# EAGLE board slave (EAGLE 9.6.2), part 1 of 3
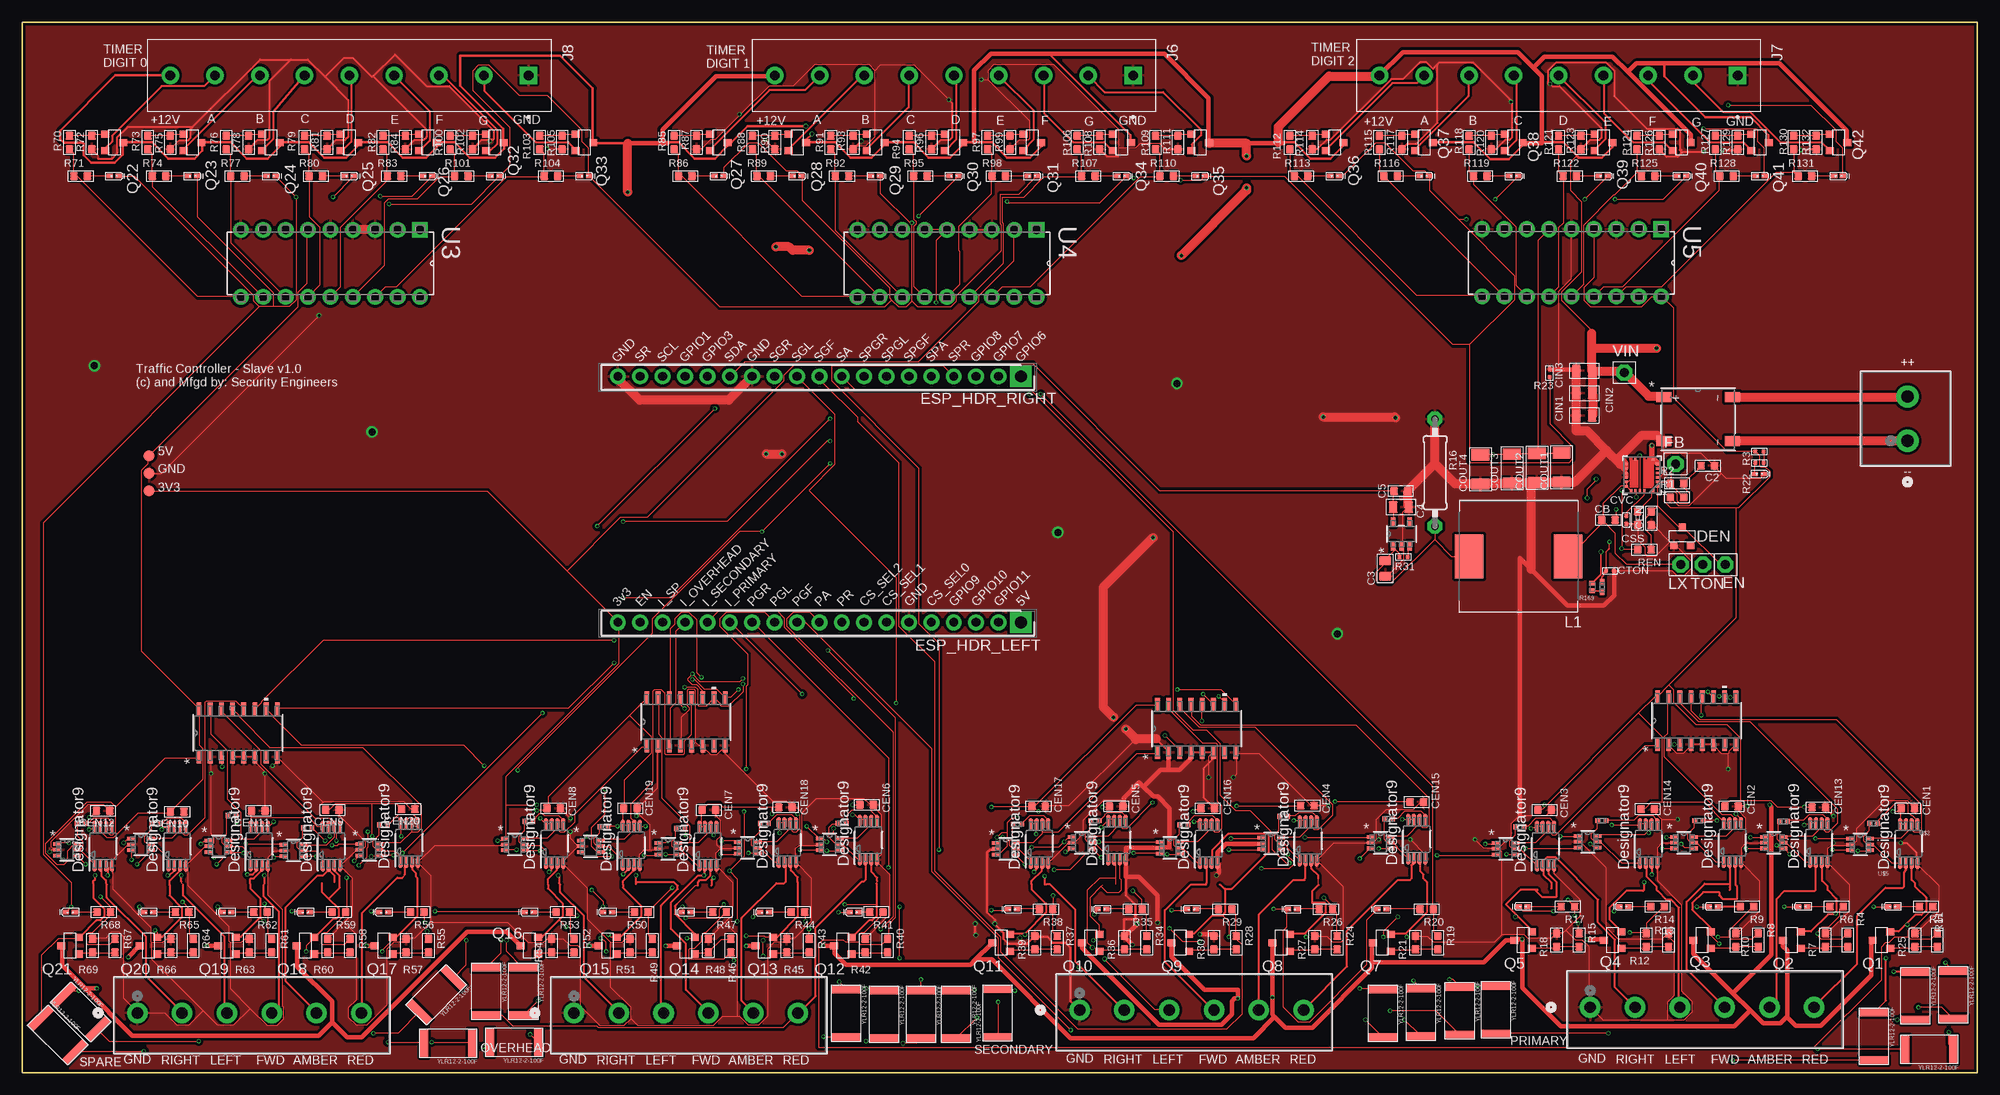
[diagram p6: board, top side]
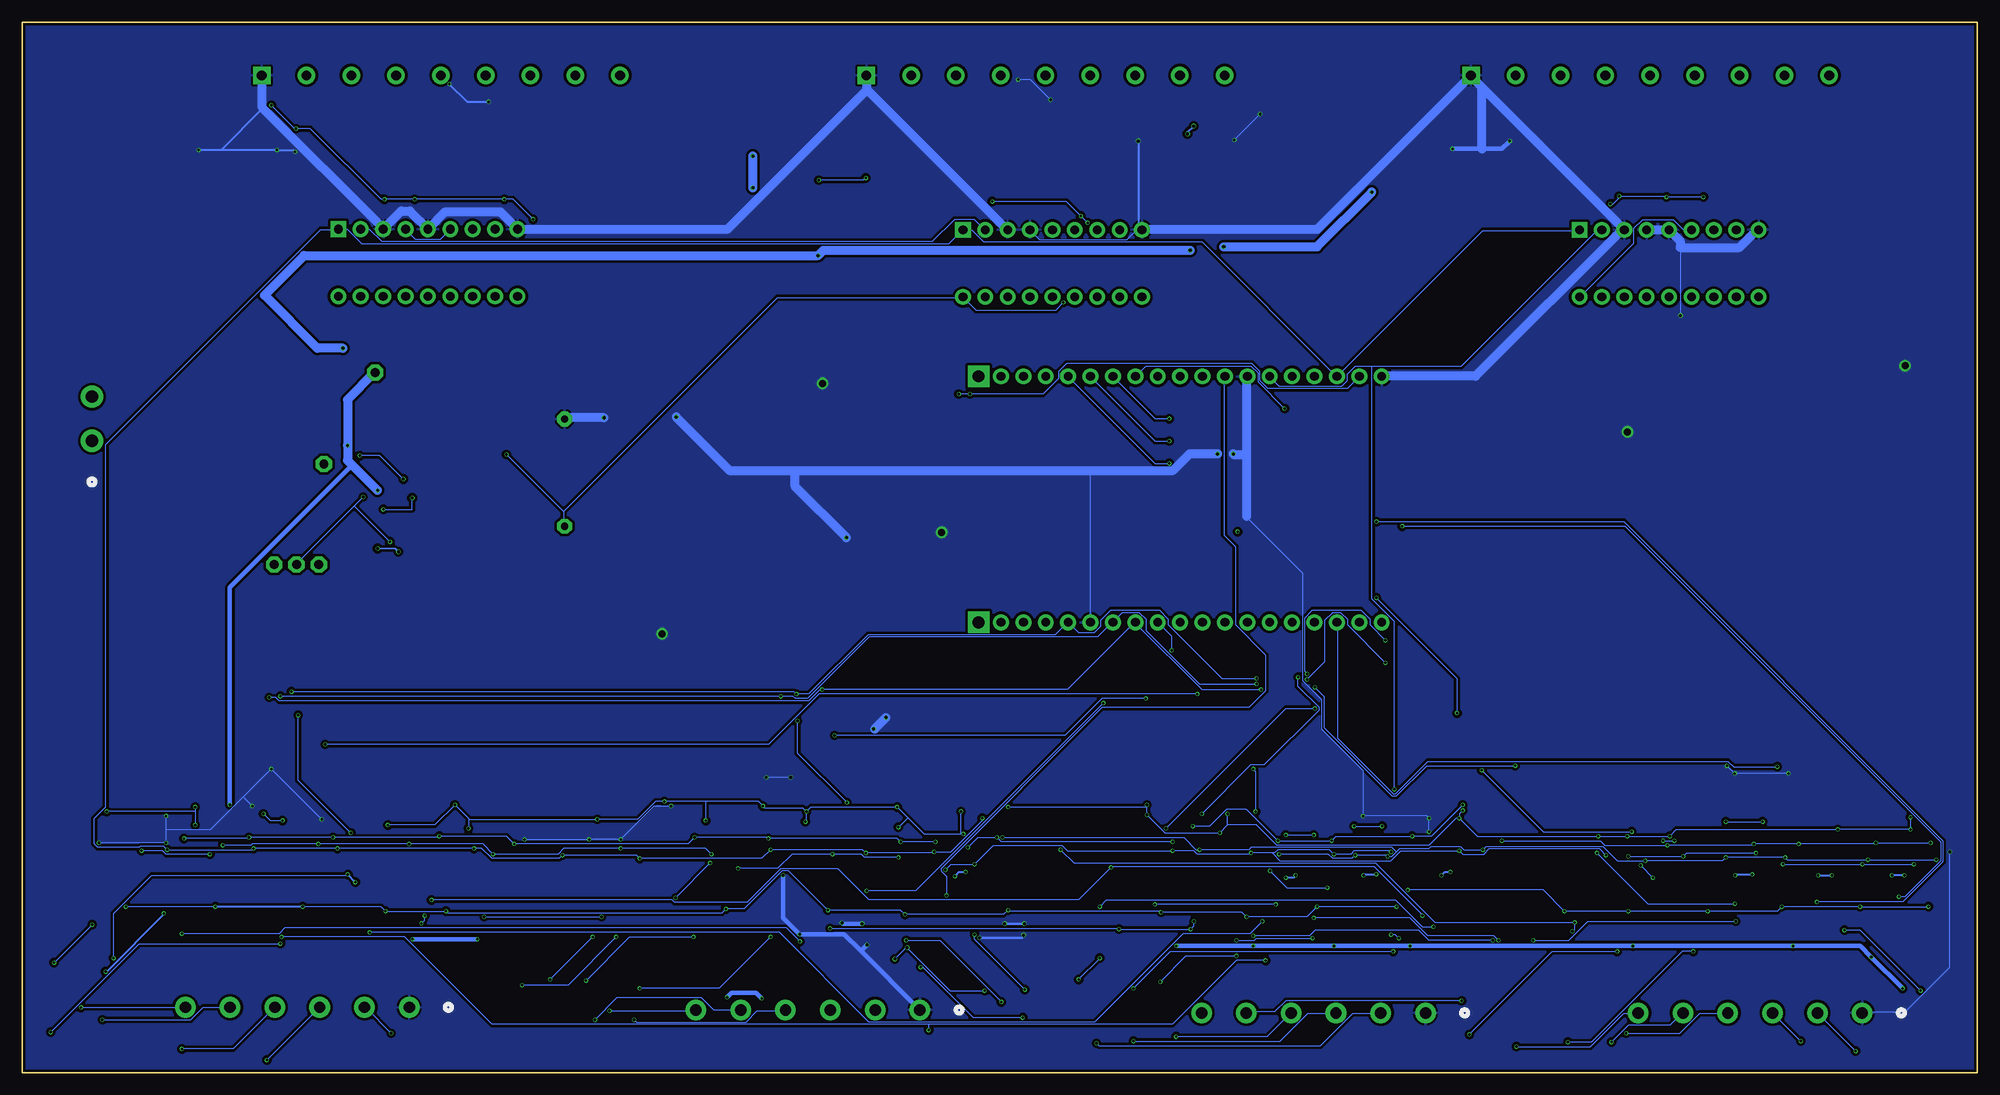
[diagram p7: board, bottom side, seen from below]

Size 221.8 x 119.2 mm. Coordinates in mm from the lower left corner, seen from the top.
Outline: 0,0 221.8,0 221.8,119.2 0,119.2 0,0
Copper layers (1*16): Top 0.035mm / dielectric 1.6mm / Bottom 0.035mm
Design rules "jlcpcb-2layers": minimum track width 5mil, minimum drill 0.3mm, track to track 5mil, track to pad 5mil, pad to pad 5mil, via to via 5mil, smd to smd 5mil, copper to edge 0.2mm, drill to drill 6mil, minimum pad ring 10mil, minimum via ring 3mil, stop-mask expansion 4mil, vias tented up to drill 0mil, thermal gap 10mil

## Footprints (pad centres in the part's own frame; a part is rotated, then mirrored left to right if it is on the bottom)
SC70-6_MC_MCH = smd 0.881 x 0.406: 1 -1.115,0.65; 2 -1.115,0; 3 -1.115,-0.65; 4 1.115,-0.65; 5 1.115,0; 6 1.115,0.65
C0603 = smd 0.889 x 0.889: 1 0,0.762; 2 0,-0.762
C0805 = smd 1.397 x 1.016: 1 0,0.889; 2 0,-0.889
C1206 = smd 1.27 x 2.032: 1 -1.651,0; 2 1.651,0
C0402 = smd 0.5 x 0.5: 1 0,0.463; 2 0,-0.463
LED_1500-GS08_VIS = smd 0.686 x 0.508: 1 -0.508,0; 2 0.508,0
SOT23 = smd 0.8 x 0.9: P$1 -0.95,-1; P$2 0.95,-1; P$3 0,1
1X1 = drill 1.016 pad 1.778 octagon: 1 0,0
RHDR19W80P0X254_1X19_4876X254X = drill 1.35 pad 2.025 square: 1 0,0 | drill 1 pad 1.778: 2 2.54,0; 3 5.08,0; 4 7.62,0; 5 10.16,0; 6 12.7,0; 7 15.24,0; 8 17.78,0; 9 20.32,0; 10 22.86,0; 11 25.4,0; 12 27.94,0; 13 30.48,0; 14 33.02,0; 15 35.56,0; 16 38.1,0; 17 40.64,0; 18 43.18,0; 19 45.72,0
CONN_EB21A-06-D_ADM = drill 1.295 pad 1.803: 1 0,0; 2 5.08,0; 3 10.16,0; 4 15.24,0; 5 20.32,0; 6 25.4,0
TE_282837-9 = drill 1.1 square: 1 -20.32,0 | drill 1.1: 2 -15.24,0; 3 -10.16,0; 4 -5.08,0; 5 0,0; 6 5.08,0; 7 10.16,0; 8 15.24,0; 9 20.32,0
CONN2_250000_WED = drill 1.397 pad 1.905: 1 0,0; 2 5.004,0
BCIH1367-2R2M = smd 3.25 x 5: P$1 -5.625,0; P$2 5.625,0
R0603 = smd 0.889 x 0.889: 1 0,0.762; 2 0,-0.762
R0402 = smd 0.5 x 0.5: 1 0,0.463; 2 0,-0.463
PR-D2.7XL8.5MM = drill 0.813 pad 1.676 octagon: 1 -5.953,0; 2 6.207,0
RES_CR-02_VKG = smd 0.508 x 0.559: 1 -0.47,0; 2 0.47,0
RESC1005X40N = smd 0.54 x 0.6: 1 -0.432,0; 2 0.432,0
RC0402N_YAG = smd 0.66 x 0.508: 1 -0.559,0; 2 0.559,0
DBF_DIO = smd 1.702 x 1.143: 1 -3.899,2.5; 2 3.899,2.5; 3 -3.899,-2.5; 4 3.899,-2.5
QFN_4X4_22L-EP2_S_AOS = smd 0.457 x 0.254: 1 -1.82,1.25; 2 -1.82,0.75; 3 -1.82,0.25; 4 -1.82,-0.25; 5 -1.82,-0.75; 6 -1.82,-1.25; 12 1.82,-1.25; 13 1.82,-0.75; 14 1.82,-0.25; 15 1.82,0.25; 16 1.82,0.75; 17 1.82,1.25 | smd 0.254 x 0.33: 7 -1.25,-1.884; 10 0.75,-1.884 | smd 0.254 x 0.457: 18 1.25,1.82; 19 0.75,1.82; 20 0.25,1.82; 21 -0.25,1.82; 22 -1.25,1.82
B1,27 = smd 1.27 x 1.27: TP 0,0
DGK0008A_N = smd 1.35 x 0.45: 1 -2.225,0.975; 2 -2.225,0.325; 3 -2.225,-0.325; 4 -2.225,-0.975; 5 2.225,-0.975; 6 2.225,-0.325; 7 2.225,0.325; 8 2.225,0.975
SOT_RG1_DIO = smd 1.003 x 0.508: 1 -1.353,0.95; 2 -1.353,0; 3 -1.353,-0.95; 4 1.353,-0.95; 5 1.353,0.95
DIP254P762X533-18 = drill 0.991 square: 1 -7.62,20.32 | drill 0.991: 2 -7.62,17.78; 3 -7.62,15.24; 4 -7.62,12.7; 5 -7.62,10.16; 6 -7.62,7.62; 7 -7.62,5.08; 8 -7.62,2.54; 9 -7.62,0; 10 0,0; 11 0,2.54; 12 0,5.08; 13 0,7.62; 14 0,10.16; 15 0,12.7; 16 0,15.24; 17 0,17.78; 18 0,20.32
SOIC-16_ONS = smd 1.499 x 0.533: 1 -2.705,4.445; 2 -2.705,3.175; 3 -2.705,1.905; 4 -2.705,0.635; 5 -2.705,-0.635; 6 -2.705,-1.905; 7 -2.705,-3.175; 8 -2.705,-4.445; 9 2.705,-4.445; 10 2.705,-3.175; 11 2.705,-1.905; 12 2.705,-0.635; 13 2.705,0.635; 14 2.705,1.905; 15 2.705,3.175; 16 2.705,4.445
YLR12-2-100F = smd 0.9 x 3.2: P$1 -2.46,-0.04; P$2 2.99,-0.04

## Placement (x,y rotation side)
3V1  MCP40D17T-503E/LT  [SC70-6_MC_MCH]  188.5,26.1 0 top
3V2  MCP40D17T-503E/LT  [SC70-6_MC_MCH]  168.3,25.4 0 top
3V3  MCP40D17T-503E/LT  [SC70-6_MC_MCH]  141.7,26 0 top
3V4  MCP40D17T-503E/LT  [SC70-6_MC_MCH]  120.2,26.1 0 top
3V5  MCP40D17T-503E/LT  [SC70-6_MC_MCH]  91.6,25.9 0 top
3V6  MCP40D17T-503E/LT  [SC70-6_MC_MCH]  73.3,25.4 0 top
3V7  MCP40D17T-503E/LT  [SC70-6_MC_MCH]  55.9,25.9 0 top
3V8  MCP40D17T-503E/LT  [SC70-6_MC_MCH]  30.8,25.2 0 top
3V9  MCP40D17T-503E/LT  [SC70-6_MC_MCH]  13.5,25.9 0 top
3V10  MCP40D17T-503E/LT  [SC70-6_MC_MCH]  22.3,25.7 0 top
3V11  MCP40D17T-503E/LT  [SC70-6_MC_MCH]  5.1,25.3 0 top
3V12  MCP40D17T-503E/LT  [SC70-6_MC_MCH]  198.7,26.1 0 top
3V13  MCP40D17T-503E/LT  [SC70-6_MC_MCH]  177.6,26.2 0 top
3V14  MCP40D17T-503E/LT  [SC70-6_MC_MCH]  154.1,26.1 0 top
3V15  MCP40D17T-503E/LT  [SC70-6_MC_MCH]  130.2,25.5 0 top
3V16  MCP40D17T-503E/LT  [SC70-6_MC_MCH]  111.6,25.4 0 top
3V17  MCP40D17T-503E/LT  [SC70-6_MC_MCH]  82.3,25.5 0 top
3V18  MCP40D17T-503E/LT  [SC70-6_MC_MCH]  64.5,25.7 0 top
3V19  MCP40D17T-503E/LT  [SC70-6_MC_MCH]  39.4,25.3 0 top
3V21  MCP40D17T-503E/LT  [SC70-6_MC_MCH]  208.5,25.9 0 top
C2  100pF  [C0603]  191.21,68.86 270 top
C3  10uF  [C0805]  154.62,57.2 180 top
C4  10uF  [C0805]  156.4,64.17 270 top
C5  1uF  [C0603]  156.39,65.98 270 top
CB  100nF  [C0603]  179.94,62.71 90 top
CEN  100nF  [C0603]  184.8,62.89 180 top
CEN1  100nF  [C0603]  213.9,30 270 top
CEN2  100nF  [C0603]  193.9,30.2 270 top
CEN3  100nF  [C0603]  172.7,29.8 270 top
CEN4  100nF  [C0603]  145.8,30.3 270 top
CEN5  100nF  [C0603]  124.1,30.2 270 top
CEN6  100nF  [C0603]  95.8,30.4 270 top
CEN7  100nF  [C0603]  77.9,29.8 270 top
CEN8  100nF  [C0603]  60.3,30 270 top
CEN9  100nF  [C0603]  35.2,29.8 270 top
CEN10  100nF  [C0603]  17.6,29.6 270 top
CEN11  100nF  [C0603]  26.8,29.7 270 top
CEN12  100nF  [C0603]  9.2,29.7 270 top
CEN13  100nF  [C0603]  203.8,30.1 270 top
CEN14  100nF  [C0603]  184.4,29.9 270 top
CEN15  100nF  [C0603]  158.2,30.7 270 top
CEN16  100nF  [C0603]  134.5,30 270 top
CEN17  100nF  [C0603]  115.3,30.2 270 top
CEN18  100nF  [C0603]  86.6,30.1 270 top
CEN19  100nF  [C0603]  69,30 270 top
CEN20  100nF  [C0603]  43.8,29.9 270 top
CIN1  10uF  [C0805]  177.2,74.55 90 top
CIN2  10uF  [C0805]  177.2,77.09 90 top
CIN3  10uF  [C0805]  177.2,79.63 90 top
COUT1  22uF  [C1206]  174.63,68.67 90 top
COUT2  22uF  [C1206]  171.83,68.62 90 top
COUT3  22uF  [C1206]  168.99,68.55 90 top
COUT4  22uF  [C1206]  165.44,68.45 90 top
CSS  47nF  [C0603]  183.25,62.91 0 top
CTON  100pF  [C0402]  180.13,56.94 90 top
CVC  4.7uF  [C0402]  181.98,62.71 0 top
D1  VLMY1500-GS08  [LED_1500-GS08_VIS]  212.17,18.85 0 top
D2  VLMY1500-GS08  [LED_1500-GS08_VIS]  202.01,18.85 0 top
D3  VLMY1500-GS08  [LED_1500-GS08_VIS]  191.85,18.85 0 top
D4  VLMY1500-GS08  [LED_1500-GS08_VIS]  181.69,18.85 0 top
D5  VLMY1500-GS08  [LED_1500-GS08_VIS]  170.26,18.85 0 top
D6  VLMY1500-GS08  [LED_1500-GS08_VIS]  154.25,18.55 0 top
D7  VLMY1500-GS08  [LED_1500-GS08_VIS]  197.07,67.92 180 top
D11  VLMY1500-GS08  [LED_1500-GS08_VIS]  144.09,18.55 0 top
D12  VLMY1500-GS08  [LED_1500-GS08_VIS]  132.66,18.55 0 top
D13  VLMY1500-GS08  [LED_1500-GS08_VIS]  122.5,18.55 0 top
D14  VLMY1500-GS08  [LED_1500-GS08_VIS]  112.34,18.55 0 top
D15  VLMY1500-GS08  [LED_1500-GS08_VIS]  94.36,18.22 0 top
D16  VLMY1500-GS08  [LED_1500-GS08_VIS]  84.2,18.22 0 top
D17  VLMY1500-GS08  [LED_1500-GS08_VIS]  75.31,18.22 0 top
D18  VLMY1500-GS08  [LED_1500-GS08_VIS]  66.42,18.22 0 top
D19  VLMY1500-GS08  [LED_1500-GS08_VIS]  57.53,18.22 0 top
D20  VLMY1500-GS08  [LED_1500-GS08_VIS]  41.02,18.22 0 top
D21  VLMY1500-GS08  [LED_1500-GS08_VIS]  32.13,18.22 0 top
D22  VLMY1500-GS08  [LED_1500-GS08_VIS]  23.24,18.22 0 top
D23  VLMY1500-GS08  [LED_1500-GS08_VIS]  14.35,18.22 0 top
D24  VLMY1500-GS08  [LED_1500-GS08_VIS]  5.46,18.22 0 top
D25  VLMY1500-GS08  [LED_1500-GS08_VIS]  10.46,101.72 180 top
D26  VLMY1500-GS08  [LED_1500-GS08_VIS]  19.35,101.72 180 top
D27  VLMY1500-GS08  [LED_1500-GS08_VIS]  28.24,101.72 180 top
D28  VLMY1500-GS08  [LED_1500-GS08_VIS]  37.13,101.72 180 top
D29  VLMY1500-GS08  [LED_1500-GS08_VIS]  46.02,101.72 180 top
D30  VLMY1500-GS08  [LED_1500-GS08_VIS]  79.04,101.72 180 top
D31  VLMY1500-GS08  [LED_1500-GS08_VIS]  87.93,101.72 180 top
D32  VLMY1500-GS08  [LED_1500-GS08_VIS]  96.82,101.72 180 top
D33  VLMY1500-GS08  [LED_1500-GS08_VIS]  105.71,101.72 180 top
D34  VLMY1500-GS08  [LED_1500-GS08_VIS]  114.6,101.72 180 top
D35  VLMY1500-GS08  [LED_1500-GS08_VIS]  53.64,101.72 180 top
D36  VLMY1500-GS08  [LED_1500-GS08_VIS]  63.8,101.72 180 top
D37  VLMY1500-GS08  [LED_1500-GS08_VIS]  124.76,101.72 180 top
D38  VLMY1500-GS08  [LED_1500-GS08_VIS]  133.65,101.72 180 top
D39  VLMY1500-GS08  [LED_1500-GS08_VIS]  148.89,101.72 180 top
D40  VLMY1500-GS08  [LED_1500-GS08_VIS]  159.05,101.72 180 top
D41  VLMY1500-GS08  [LED_1500-GS08_VIS]  169.21,101.72 180 top
D42  VLMY1500-GS08  [LED_1500-GS08_VIS]  179.37,101.72 180 top
D43  VLMY1500-GS08  [LED_1500-GS08_VIS]  188.26,101.72 180 top
D44  VLMY1500-GS08  [LED_1500-GS08_VIS]  197.15,101.72 180 top
D45  VLMY1500-GS08  [LED_1500-GS08_VIS]  206.04,101.72 180 top
DEN  BZX84C5V1-7-F  [SOT23]  188.31,60.84 0 top
EN  CONN_HDR_1POS_0.1  [1X1]  193.21,57.64 0 top
ESP_HDR_LEFT  PPTC191LFBN-RC  [RHDR19W80P0X254_1X19_4876X254X]  113.3,51.1 180 top
ESP_HDR_RIGHT  PPTC191LFBN-RC  [RHDR19W80P0X254_1X19_4876X254X]  113.3,79 180 top
FB  CONN_HDR_1POS_0.1  [1X1]  187.56,69.06 0 top
J2  EB21A-06-D  [CONN_EB21A-06-D_ADM]  177.88,7.42 0 top
J3  EB21A-06-D  [CONN_EB21A-06-D_ADM]  119.96,7.12 0 top
J4  EB21A-06-D  [CONN_EB21A-06-D_ADM]  62.61,6.79 0 top
J5  EB21A-06-D  [CONN_EB21A-06-D_ADM]  13.08,6.79 0 top
J6  282837-9  [TE_282837-9]  105.71,113.15 180 top
J7  282837-9  [TE_282837-9]  174.29,113.15 180 top
J8  282837-9  [TE_282837-9]  37.13,113.15 180 top
J9  1715250000  [CONN2_250000_WED]  213.87,71.7 90 top
L1  1.5uH  [BCIH1367-2R2M]  169.76,58.57 180 top
LX  CONN_HDR_1POS_0.1  [1X1]  188.13,57.64 0 top
Q1  DMN2056U-7  [SOT23]  210.9,15.04 90 top
Q2  DMN2056U-7  [SOT23]  200.74,15.04 90 top
Q3  DMN2056U-7  [SOT23]  190.58,15.04 90 top
Q4  DMN2056U-7  [SOT23]  180.42,15.04 90 top
Q5  DMN2056U-7  [SOT23]  170.26,15.04 90 top
Q7  DMN2056U-7  [SOT23]  154.25,14.74 90 top
Q8  DMN2056U-7  [SOT23]  142.82,14.74 90 top
Q9  DMN2056U-7  [SOT23]  131.39,14.74 90 top
Q10  DMN2056U-7  [SOT23]  121.23,14.74 90 top
Q11  DMN2056U-7  [SOT23]  111.07,14.74 90 top
Q12  DMN2056U-7  [SOT23]  93.09,14.41 90 top
Q13  DMN2056U-7  [SOT23]  84.2,14.41 90 top
Q14  DMN2056U-7  [SOT23]  75.31,14.41 90 top
Q15  DMN2056U-7  [SOT23]  66.42,14.41 90 top
Q16  DMN2056U-7  [SOT23]  57.53,14.41 90 top
Q17  DMN2056U-7  [SOT23]  41.02,14.41 90 top
Q18  DMN2056U-7  [SOT23]  32.13,14.41 90 top
Q19  DMN2056U-7  [SOT23]  23.24,14.41 90 top
Q20  DMN2056U-7  [SOT23]  14.35,14.41 90 top
Q21  DMN2056U-7  [SOT23]  5.46,14.41 90 top
Q22  DMN2056U-7  [SOT23]  10.46,105.53 270 top
Q23  DMN2056U-7  [SOT23]  19.35,105.53 270 top
Q24  DMN2056U-7  [SOT23]  28.24,105.53 270 top
Q25  DMN2056U-7  [SOT23]  37.13,105.53 270 top
Q26  DMN2056U-7  [SOT23]  46.02,105.53 270 top
Q27  DMN2056U-7  [SOT23]  79.04,105.53 270 top
Q28  DMN2056U-7  [SOT23]  87.93,105.53 270 top
Q29  DMN2056U-7  [SOT23]  96.82,105.53 270 top
Q30  DMN2056U-7  [SOT23]  105.71,105.53 270 top
Q31  DMN2056U-7  [SOT23]  114.6,105.53 270 top
Q32  DMN2056U-7  [SOT23]  53.64,105.53 270 top
Q33  DMN2056U-7  [SOT23]  63.8,105.53 270 top
Q34  DMN2056U-7  [SOT23]  124.76,105.53 270 top
Q35  DMN2056U-7  [SOT23]  133.65,105.53 270 top
Q36  DMN2056U-7  [SOT23]  148.89,105.53 270 top
Q37  DMN2056U-7  [SOT23]  159.05,105.53 270 top
Q38  DMN2056U-7  [SOT23]  169.21,105.53 270 top
Q39  DMN2056U-7  [SOT23]  179.37,105.53 270 top
Q40  DMN2056U-7  [SOT23]  188.26,105.53 270 top
Q41  DMN2056U-7  [SOT23]  197.15,105.53 270 top
Q42  DMN2056U-7  [SOT23]  206.04,105.53 270 top
R1  5.1k  [R0603]  187.72,65.28 270 top
R2  27k  [R0603]  187.72,66.86 270 top
R3  1k  [R0402]  197.07,70.46 270 top
R4  220  [R0603]  207.09,15.04 180 top
R5  150  [R0603]  215.98,18.85 90 top
R6  150  [R0603]  205.82,18.85 90 top
R7  6.8k  [R0603]  204.55,15.04 0 top
R8  220  [R0603]  196.93,15.04 180 top
R9  150  [R0603]  195.66,18.85 90 top
R10  6.8k  [R0603]  194.39,15.04 0 top
R11  220  [R0603]  217.25,15.04 180 top
R12  220  [R0603]  184.23,15.04 180 top
R13  150  [R0603]  185.5,18.85 90 top
R14  6.8k  [R0603]  186.77,15.04 0 top
R15  220  [R0603]  176.61,15.04 180 top
R16  100R  [PR-D2.7XL8.5MM]  160.27,68.2 270 top
R17  150  [R0603]  175.34,18.85 90 top
R18  6.8k  [R0603]  174.07,15.04 0 top
R19  220  [R0603]  160.6,14.74 180 top
R20  150  [R0603]  159.33,18.55 90 top
R21  6.8k  [R0603]  158.06,14.74 0 top
R22  0R  [R0402]  197.07,69.19 90 top
R23  0R  [R0402]  173.26,79.39 0 top
R24  220  [R0603]  149.17,14.74 180 top
R25  6.8k  [R0603]  214.71,15.04 0 top
R26  150  [R0603]  147.9,18.55 90 top
R27  6.8k  [R0603]  146.63,14.74 0 top
R28  220  [R0603]  137.74,14.74 180 top
R29  150  [R0603]  136.47,18.55 90 top
R30  6.8k  [R0603]  135.2,14.74 0 top
R31  100k  [R0402]  156.7,58.5 270 top
R32  CR-02JL6----1K  [RES_CR-02_VKG]  190.2,28.6 0 top
R33  CR-02JL6----1K  [RES_CR-02_VKG]  169.9,27.9 0 top
R34  220  [R0603]  127.58,14.74 180 top
R35  150  [R0603]  126.31,18.55 90 top
R36  6.8k  [R0603]  125.04,14.74 0 top
R37  220  [R0603]  117.42,14.74 180 top
R38  150  [R0603]  116.15,18.55 90 top
R39  6.8k  [R0603]  114.88,14.74 0 top
R40  220  [R0603]  98.17,14.41 180 top
R41  150  [R0603]  96.9,18.22 90 top
R42  6.8k  [R0603]  95.63,14.41 0 top
R43  220  [R0603]  89.28,14.41 180 top
R44  150  [R0603]  88.01,18.22 90 top
R45  6.8k  [R0603]  86.74,14.41 0 top
R46  220  [R0603]  80.39,14.41 0 top
R47  150  [R0603]  79.12,18.22 90 top
R48  6.8k  [R0603]  77.85,14.41 0 top
R49  220  [R0603]  71.5,14.41 180 top
R50  150  [R0603]  70.23,18.22 90 top
R51  6.8k  [R0603]  68.96,14.41 0 top
R52  220  [R0603]  62.61,14.41 180 top
R53  150  [R0603]  61.34,18.22 90 top
R54  6.8k  [R0603]  60.07,14.41 0 top
R55  220  [R0603]  46.1,14.41 180 top
R56  150  [R0603]  44.83,18.22 90 top
R57  6.8k  [R0603]  43.56,14.41 0 top
R58  220  [R0603]  37.21,14.41 180 top
R59  150  [R0603]  35.94,18.22 90 top
R60  6.8k  [R0603]  34.67,14.41 0 top
R61  220  [R0603]  28.32,14.41 180 top
R62  150  [R0603]  27.05,18.22 90 top
R63  6.8k  [R0603]  25.78,14.41 0 top
R64  220  [R0603]  19.43,14.41 180 top
R65  150  [R0603]  18.16,18.22 90 top
R66  6.8k  [R0603]  16.89,14.41 0 top
R67  220  [R0603]  10.54,14.41 180 top
R68  150  [R0603]  9.27,18.22 90 top
R69  6.8k  [R0603]  8,14.41 0 top
R70  220  [R0603]  5.38,105.53 0 top
R71  150  [R0603]  6.65,101.72 270 top
R72  6.8k  [R0603]  7.92,105.53 180 top
R73  220  [R0603]  14.27,105.53 0 top
R74  150  [R0603]  15.54,101.72 270 top
R75  6.8k  [R0603]  16.81,105.53 180 top
R76  220  [R0603]  23.16,105.53 0 top
R77  150  [R0603]  24.43,101.72 270 top
R78  6.8k  [R0603]  25.7,105.53 180 top
R79  220  [R0603]  32.05,105.53 0 top
R80  150  [R0603]  33.32,101.72 270 top
R81  6.8k  [R0603]  34.59,105.53 180 top
R82  220  [R0603]  40.94,105.53 0 top
R83  150  [R0603]  42.21,101.72 270 top
R84  6.8k  [R0603]  43.48,105.53 180 top
R85  220  [R0603]  73.96,105.53 0 top
R86  150  [R0603]  75.23,101.72 270 top
R87  6.8k  [R0603]  76.5,105.53 180 top
R88  220  [R0603]  82.85,105.53 0 top
R89  150  [R0603]  84.12,101.72 270 top
R90  6.8k  [R0603]  85.39,105.53 180 top
R91  220  [R0603]  91.74,105.53 0 top
R92  150  [R0603]  93.01,101.72 270 top
R93  6.8k  [R0603]  94.28,105.53 180 top
R94  220  [R0603]  100.63,105.53 0 top
R95  150  [R0603]  101.9,101.72 270 top
R96  6.8k  [R0603]  103.17,105.53 180 top
R97  220  [R0603]  109.52,105.53 0 top
R98  150  [R0603]  110.79,101.72 270 top
R99  6.8k  [R0603]  112.06,105.53 180 top
R100  220  [R0603]  48.56,105.53 0 top
R101  150  [R0603]  49.83,101.72 270 top
R102  6.8k  [R0603]  51.1,105.53 180 top
R103  220  [R0603]  58.72,105.53 0 top
R104  150  [R0603]  59.99,101.72 270 top
R105  6.8k  [R0603]  61.26,105.53 180 top
R106  220  [R0603]  119.68,105.53 0 top
R107  150  [R0603]  120.95,101.72 270 top
R108  6.8k  [R0603]  122.22,105.53 180 top
R109  220  [R0603]  128.57,105.53 0 top
R110  150  [R0603]  129.84,101.72 270 top
R111  6.8k  [R0603]  131.11,105.53 180 top
R112  220  [R0603]  143.81,105.53 0 top
R113  150  [R0603]  145.08,101.72 270 top
R114  6.8k  [R0603]  146.35,105.53 180 top
R115  220  [R0603]  153.97,105.53 0 top
R116  150  [R0603]  155.24,101.72 270 top
R117  6.8k  [R0603]  156.51,105.53 180 top
R118  220  [R0603]  164.13,105.53 0 top
R119  150  [R0603]  165.4,101.72 270 top
R120  6.8k  [R0603]  166.67,105.53 180 top
R121  220  [R0603]  174.29,105.53 0 top
R122  150  [R0603]  175.56,101.72 270 top
R123  6.8k  [R0603]  176.83,105.53 180 top
R124  220  [R0603]  183.18,105.53 0 top
R125  150  [R0603]  184.45,101.72 270 top
R126  6.8k  [R0603]  185.72,105.53 180 top
R127  220  [R0603]  192.07,105.53 0 top
R128  150  [R0603]  193.34,101.72 270 top
R129  6.8k  [R0603]  194.61,105.53 180 top
R130  220  [R0603]  200.96,105.53 0 top
R131  150  [R0603]  202.23,101.72 270 top
R132  6.8k  [R0603]  203.5,105.53 180 top
R133  CR-02JL6----1K  [RES_CR-02_VKG]  143.1,29.1 0 top
R134  CR-02JL6----1K  [RES_CR-02_VKG]  121.7,28.6 0 top
R135  CR-02JL6----1K  [RES_CR-02_VKG]  93,28.3 0 top
R136  CR-02JL6----1K  [RES_CR-02_VKG]  74.7,27.7 0 top
R137  CR-02JL6----1K  [RES_CR-02_VKG]  57.5,28.5 0 top
R138  CR-02JL6----1K  [RES_CR-02_VKG]  32.4,27.8 0 top
R139  CR-02JL6----1K  [RES_CR-02_VKG]  15.2,28.3 0 top
R140  CR-02JL6----1K  [RES_CR-02_VKG]  23.8,29.2 0 top
R141  CR-02JL6----1K  [RES_CR-02_VKG]  6.7,28.3 0 top
R142  CR-02JL6----1K  [RES_CR-02_VKG]  199.8,28.5 0 top
R143  CR-02JL6----1K  [RES_CR-02_VKG]  179.2,28.6 0 top
R144  CR-02JL6----1K  [RES_CR-02_VKG]  155,28.8 0 top
R145  CR-02JL6----1K  [RES_CR-02_VKG]  131.8,28.1 0 top
R146  CR-02JL6----1K  [RES_CR-02_VKG]  112.9,28.2 0 top
R147  CR-02JL6----1K  [RES_CR-02_VKG]  84.2,28.3 0 top
R148  CR-02JL6----1K  [RES_CR-02_VKG]  66,27.9 0 top
R149  CR-02JL6----1K  [RES_CR-02_VKG]  41,28.1 0 top
R169  RC0402FR-07698KL  [RESC1005X40N]  178.1,55.1 90 top
R170  RC0402FR-0782K5L  [RC0402N_YAG]  179.2,55.1 270 top
R171  CR-02JL6----1K  [RES_CR-02_VKG]  210,28.3 0 top
RECT  DBF310-13  [DBF_DIO]  190.1,74.14 0 top
REG  AOZ2255EQI-30  [QFN_4X4_22L-EP2_S_AOS]  183.75,67.79 180 top
REN  1k  [R0603]  184.02,59.34 90 top
TON  CONN_HDR_1POS_0.1  [1X1]  190.67,57.64 0 top
TP1  TPB1,27  [B1,27]  14.4,70 0 top
TP4  TPB1,27  [B1,27]  14.4,68 0 top
TP5  TPB1,27  [B1,27]  14.4,66 0 top
U1  INA332AIDGKR  [DGK0008A_N]  194,26.1 90 top
U2  AP2112K-3.3TRG1  [SOT_RG1_DIO]  156.47,61.12 90 top
U3  MCP23008-E/P  [DIP254P762X533-18]  24.82,88.01 270 top
U4  MCP23008-E/P  [DIP254P762X533-18]  94.76,88.01 270 top
U5  MCP23008-E/P  [DIP254P762X533-18]  165.6,88.08 270 top
U6  MC74HCT4851ADR2G  [SOIC-16_ONS]  189.95,39.94 90 top
U7  MC74HCT4851ADR2G  [SOIC-16_ONS]  75.31,39.81 90 top
U8  MC74HCT4851ADR2G  [SOIC-16_ONS]  133.23,39.04 90 top
U9  MC74HCT4851ADR2G  [SOIC-16_ONS]  24.51,38.54 90 top
U10  INA332AIDGKR  [DGK0008A_N]  172.8,25.7 90 top
U11  INA332AIDGKR  [DGK0008A_N]  145.9,26.3 90 top
U12  INA332AIDGKR  [DGK0008A_N]  124.2,26.4 90 top
U13  INA332AIDGKR  [DGK0008A_N]  96,26.4 90 top
U14  INA332AIDGKR  [DGK0008A_N]  77.8,25.7 90 top
U15  INA332AIDGKR  [DGK0008A_N]  60.4,26 90 top
U16  INA332AIDGKR  [DGK0008A_N]  35.1,25.7 90 top
U17  INA332AIDGKR  [DGK0008A_N]  17.6,25.7 90 top
U18  INA332AIDGKR  [DGK0008A_N]  26.9,25.7 90 top
U19  INA332AIDGKR  [DGK0008A_N]  214,26 90 top
U20  INA332AIDGKR  [DGK0008A_N]  9.2,25.7 90 top
U21  INA332AIDGKR  [DGK0008A_N]  203.8,26.1 90 top
U22  INA332AIDGKR  [DGK0008A_N]  184.5,26 90 top
U23  INA332AIDGKR  [DGK0008A_N]  158.2,26.5 90 top
U24  INA332AIDGKR  [DGK0008A_N]  134.6,26 90 top
U25  INA332AIDGKR  [DGK0008A_N]  115.4,26 90 top
U26  INA332AIDGKR  [DGK0008A_N]  86.8,26.1 90 top
U27  INA332AIDGKR  [DGK0008A_N]  69.1,25.8 90 top
U28  INA332AIDGKR  [DGK0008A_N]  43.9,26.1 90 top
U$1  YLR12-2-100F  [YLR12-2-100F]  219.1,9.1 270 top
U$2  YLR12-2-100F  [YLR12-2-100F]  214.8,9 270 top
U$4  YLR12-2-100F  [YLR12-2-100F]  216.6,2.6 180 top
U$5  YLR12-2-100F  [YLR12-2-100F]  210.1,4.4 270 top
U$6  YLR12-2-100F  [YLR12-2-100F]  167.2,7.4 270 top
U$7  YLR12-2-100F  [YLR12-2-100F]  163.1,7.3 270 top
U$8  YLR12-2-100F  [YLR12-2-100F]  158.7,7.1 270 top
U$9  YLR12-2-100F  [YLR12-2-100F]  154.4,7 270 top
U$10  YLR12-2-100F  [YLR12-2-100F]  110.6,6.5 90 top
U$11  YLR12-2-100F  [YLR12-2-100F]  106,6.9 270 top
U$12  YLR12-2-100F  [YLR12-2-100F]  102,6.9 270 top
U$13  YLR12-2-100F  [YLR12-2-100F]  97.8,6.9 270 top
U$14  YLR12-2-100F  [YLR12-2-100F]  93.5,7 270 top
U$15  YLR12-2-100F  [YLR12-2-100F]  56.9,9.5 270 top
U$16  YLR12-2-100F  [YLR12-2-100F]  52.7,9.5 270 top
U$17  YLR12-2-100F  [YLR12-2-100F]  56.1,3.4 180 top
U$18  YLR12-2-100F  [YLR12-2-100F]  48.6,3.3 180 top
U$19  YLR12-2-100F  [YLR12-2-100F]  47.2,9 225 top
U$20  YLR12-2-100F  [YLR12-2-100F]  6.5,7.1 315 top
U$21  YLR12-2-100F  [YLR12-2-100F]  3.9,4.5 315 top
VIN  CONN_HDR_1POS_0.1  [1X1]  181.75,79.43 0 top

## Tracks (layer width: path | path; a pad name or v marks a point on that pad's centre or on a via)
3V3  (via drill 0.3)
  Top 0.127: U2.5 155.55,62.52 155.55,64.17 C4.2 155.55,64.3 155.55,65.95 C5.2 155.55,66.07 129,66.07 114.65,80.42 87.73,80.42 86.46,79.15 86.46,78.52 70.97,63.03 67.92,63.03 61.82,56.93 | TP5.TP 14.45,65.95 52.8,65.95 61.82,56.93 | v111.22,26.7 110.59,26.07 3V16.1 | v114.53,25.56 117.57,25.56 v118.21,26.2 118.72,26.7 118.97,26.7 3V4.1 | v122.15,26.2 129,26.2 3V15.1 | v137.13,26.58 140.56,26.58 3V3.1 | v145.51,26.7 152.88,26.7 3V14.1 | v165.96,25.94 167.1,25.94 3V2.1 | v174.47,26.83 176.38,26.83 3V13.1 | v186.53,26.7 187.3,26.7 3V1.1 | v196.06,26.7 197.58,26.7 3V12.1 | v203.43,26.58 207.36,26.58 3V21.1 | v5.31,26.07 4.04,26.07 3V11.1 | v11.53,26.07 11.91,26.45 12.29,26.45 3V9.1 | v25.37,25.94 29.56,25.94 3V8.1 | v35.15,25.81 35.79,25.81 35.91,25.94 38.2,25.94 3V19.1 | v20.29,25.94 20.67,26.32 21.18,26.32 3V10.1 | v73.25,26.32 73,26.07 72.24,26.07 3V6.1 | v79.35,26.32 81,26.32 81.12,26.2 3V17.1 | v64.11,26.83 63.73,26.45 63.47,26.45 3V18.1 | v89,27.97 90.4,26.58 3V5.1 90.52,26.45 91.03,26.45 v91.28,26.2 | 54.84,30.39 54.84,33.56 67.66,46.39 67.66,51.09 ESP_HDR_LEFT.19 67.54,51.21 61.82,56.93 | 54.84,30.39 54.84,26.58 3V7.1 54.71,26.45 54.58,26.32 v53.95,26.32 | 54.84,30.39 v58.39,30.39
  Bottom 0.127: v114.53,25.56 113.38,26.7 v111.22,26.7 110.72,26.2 v91.28,26.2 | v118.21,26.2 v122.15,26.2 122.53,26.58 v137.13,26.58 137.26,26.7 v145.51,26.7 146.28,25.94 v165.96,25.94 166.85,26.83 v174.47,26.83 174.6,26.7 v186.53,26.7 v196.06,26.7 196.19,26.58 v203.43,26.58 | v5.31,26.07 v11.53,26.07 11.66,25.94 v20.29,25.94 v25.37,25.94 25.5,25.81 v35.15,25.81 42.26,25.81 42.77,26.32 v53.95,26.32 | v89,27.97 87.09,27.97 85.19,29.88 82.9,29.88 v79.35,26.32 v73.25,26.32 72.74,26.83 v64.11,26.83 61.95,26.83 v58.39,30.39
+5V  (via drill 0.3)
  Top 0.127: U3.6 32.36,95.54 32.36,89.57 31.34,88.55 31.34,86.9 14.45,70.01 TP1.TP 14.32,69.88 14.32,69.12 13.56,68.36 13.56,47.78 20.04,41.31 U9.16 20.16,41.18 20.16,37.12 20.55,36.74 20.55,33.31 16.86,29.62 CEN10.2 16.74,29.5 13.18,29.5 10.39,26.7 9.62,26.7 8.99,27.34 8.99,27.85 U20.7 8.86,27.97 8.23,27.97 U20.8 8.1,27.85 7.85,27.59 v7.59,27.59 | C2.2 190.34,68.74 188.57,66.96 R2.1 188.57,66.83 188.57,66.33 189.2,65.69 189.2,64.8 188.95,64.55 188.06,64.55 187.68,64.93 187.68,65.69 187.42,65.95 186.41,65.95 186.28,65.82 186.28,64.8 187.04,64.04 194.41,64.04 | 194.41,64.04 194.66,64.04 198.22,67.6 198.22,68.23 197.71,68.74 197.2,68.74 197.08,68.87 197.08,70.01 196.69,70.39 R3.2 196.57,70.52 193.39,70.52 187.3,76.61 187.3,86.77 186.03,88.04 U5.18 185.9,88.04 184.88,88.04 183.74,86.9 177.9,86.9 177.14,87.66 177.14,89.06 178.28,90.2 178.28,95.66 U5.4 | U4.6 102.46,95.66 104.87,95.66 U4.5 103.69,94.4 v103.69,87.4 | 155.8,59.34 155.42,59.72 U2.1 | 155.8,59.34 156.18,58.96 156.18,58.58 R31.2 | 155.8,59.34 154.66,58.2 C3.2 154.53,58.07 154.53,57.69 153.64,56.8 153.64,55.79 153.9,55.53 155.29,55.53 160.25,60.48 | 160.25,60.48 160.25,61.88 R16.2 | 160.25,60.48 162.15,58.58 164.06,58.58 L1.P$2 | COUT2.2 171.93,70.26 174.6,70.26 COUT1.2 | COUT4.2 165.45,70.14 v166.85,70.14 168.88,70.14 COUT3.2 169.01,70.26 171.8,70.26 COUT2.2 | COUT2.2 171.93,70.39 171.93,94.39 173.2,95.66 U5.6 | 194.41,64.04 194.41,51.59 186.79,43.98 | U17.7 17.24,27.97 16.74,27.97 U17.8 16.61,27.85 16.1,27.85 v15.85,27.59 | v7.59,28.99 7.72,28.99 8.35,29.62 CEN12.2 | 76.93,27.97 77.06,28.1 77.06,29.75 CEN7.2 77.19,29.88 77.82,30.51 79.09,30.51 79.47,30.13 85.06,30.13
  Top 0.127: 85.06,30.13 85.82,30.13 CEN18.2 | 76.93,27.97 77.44,27.97 U14.7 | 76.93,27.97 U14.8 | U26.7 86.46,28.35 85.95,28.35 U26.8 85.95,28.23 v85.95,27.21 | v94.21,30.39 94.97,30.39 CEN6.2 | v94.21,29.24 94.46,29.24 94.97,28.73 U13.8 95.09,28.73 95.6,28.73 U13.7 | v85.06,29.37 85.06,30.13 | 26.01,27.97 26.01,28.99 | 26.01,28.99 26.01,29.62 CEN11.2 | 26.01,27.97 26.52,27.97 U18.7 | 26.01,27.97 U18.8 | 26.01,28.99 32.48,28.99 33.5,27.97 34.01,27.97 U16.8 34.14,27.97 34.77,27.97 U16.7 34.9,27.85 v34.9,26.83 | 39.72,30.51 42.52,30.51 43.03,30.01 CEN20.2 | 39.72,30.51 35.53,30.51 34.9,29.88 34.52,29.88 CEN9.2 | 68.17,28.1 68.17,29.88 CEN19.2 68.3,30.01 68.3,33.18 71.35,36.23 71.35,38.13 68.93,40.55 | 68.17,28.1 68.68,28.1 U27.7 | 68.17,28.1 U27.8 | U28.7 43.53,28.35 43.03,28.35 U28.8 43.03,28.23 v43.03,26.83 | U15.7 60.04,28.23 59.53,28.23 U15.8 59.41,28.23 v58.77,28.86 | 68.93,40.55 70.84,42.45 U7.16 | 68.93,40.55 59.66,31.27 59.66,30.01 CEN8.2 59.53,29.88 59.41,29.75 v58.39,29.75 | v39.72,26.83 39.72,30.51 | 114.91,30.26 114.65,30.26 CEN17.2 | 114.91,30.26 126.34,41.69 128.75,41.69 U8.16 | U23.7 157.83,28.73 157.32,28.73 U23.8 157.2,28.73 v156.56,28.73 | U11.7 145.51,28.61 145.01,28.61 U11.8 144.88,28.61 v144.24,28.61 | U12.7 123.8,28.73 123.29,28.73 U12.8 123.16,28.61 v122.4,27.85 | U25.8 114.53,28.23 115.03,28.23 U25.7 115.03,28.1 v115.03,27.08 | v132.81,29.62 133.07,29.88 133.7,29.88 CEN16.2 | v132.94,28.48 133.32,28.48 133.58,28.23 U24.8 133.7,28.23 134.21,28.23 U24.7 | v122.53,30.13 123.29,30.13 CEN5.2 | v137.77,30.26 145.01,30.26 CEN4.2 | v148.94,30.77 157.32,30.77 CEN15.2 | 114.91,30.26 114.91,30.01 v115.29,29.62
  Top 0.127: 114.91,30.26 CEN17.2 | 213.08,28.23 213.08,29.62 | 213.08,29.62 213.08,29.88 CEN1.2 213.08,29.62 | 213.08,28.23 213.59,28.23 U19.7 | 213.08,28.23 U19.8 | U21.7 203.43,28.35 202.92,28.35 U21.8 202.79,28.23 202.28,28.23 v202.16,28.1 | 194.92,30.89 193.77,30.89 193.14,30.26 CEN2.2 | 194.92,30.89 198.35,30.89 199.11,30.13 v202.16,30.13 202.92,30.13 CEN13.2 | v212.19,29.62 213.08,29.62 | 186.03,30.64 190.85,30.64 193.14,28.35 | 186.03,30.64 184.76,30.64 184.12,30.01 183.74,30.01 CEN14.2 | 193.14,28.35 193.65,28.35 U1.7 | 193.14,28.35 U1.8 | U22.7 184.12,28.23 183.61,28.23 U22.8 183.49,28.1 v180.31,28.1 | U10.7 172.44,27.97 171.93,27.97 U10.8 171.8,27.85 171.3,27.85 v171.17,27.72 | 183.36,40.8 185.14,42.58 185.39,42.58 U6.16 185.52,42.7 186.79,43.98 | 183.36,40.8 172.82,30.26 | 172.82,30.26 172.44,29.88 172.06,29.88 CEN3.2 | 172.82,30.26 v172.69,30.39 | 186.03,30.64 186.03,38.13 183.36,40.8 | 194.92,30.89 194.92,38.01 193.39,39.53 189.84,39.53 187.3,42.07 187.3,43.47 186.79,43.98 | v109.95,30.13 114.53,30.13 CEN17.2
  Bottom 0.127: U3.6 32.48,95.66 33.37,95.66 34.52,96.81 37.94,96.81 38.96,95.79 38.96,94.14 45.06,88.04 U3.18 | v103.69,87.4 104.54,86.54 113.61,86.54 U4.18 115.16,87.92 136.12,87.92 160.37,63.66 | U5.4 177.19,94.59 174.33,94.59 U5.6 | 160.37,63.66 160.37,62.01 R16.2 | v166.85,70.14 160.37,63.66 | v7.59,28.99 v7.59,27.59 v15.85,27.59 34.14,27.59 v34.9,26.83 v39.72,26.83 v43.03,26.83 56.74,26.83 v58.77,28.86 | 94.21,30.13 v94.21,29.24 92.17,27.21 v85.95,27.21 85.06,28.1 | 94.21,30.13 v94.21,30.39 | 85.06,28.1 v85.06,29.37 | v58.77,28.86 58.77,29.37 v58.39,29.75 | 85.06,28.1 81.76,28.1 79.47,25.81 62.2,25.81 59.15,28.86 v58.77,28.86 | v132.81,29.62 132.81,28.61 v132.94,28.48 | v132.81,29.62 132.31,30.13 v122.53,30.13 121.26,28.86 | v132.81,29.62 133.25,30.06 137.57,30.06 v137.77,30.26 138.28,30.77 144.24,30.77 | 144.24,30.77 v148.94,30.77 149.96,30.77 151.99,28.73 v156.56,28.73 171.17,28.73 | 115.29,27.08 119.48,27.08 121.26,28.86 | 115.29,27.08 v115.03,27.08 | v122.4,27.85 121.38,28.86 121.26,28.86 | 144.24,30.77 v144.24,28.61 | 115.29,27.08 v115.29,29.62 | v202.16,30.13 202.16,29.62 | 202.16,29.62 v202.16,28.1 | 202.16,29.62 v212.19,29.62 | 171.17,28.73 171.17,28.86 v172.69,30.39 174.98,28.1 v180.31,28.1 | 171.17,28.73 v171.17,27.72 | v109.95,30.13 94.21,30.13
+12V
  Top 0.127: 194.03,76.61 RECT.2 | 213.84,76.61 J9.2
  Top 1: 213.84,76.61 194.03,76.61
BST  (via drill 0.3, 0.35)
  Top 0.127: v183.49,70.01 183.49,66.07 REG.20 | v180.82,63.91 180.82,62.77 CB.2 | v177.55,65.19 177.55,66.25 178.6,67.3 v178.55,67.35
  Bottom 0.127: 183.49,69.86 v183.49,70.01 181.21,70.01 v178.55,67.35 | v180.82,63.91 177.55,63.91 v177.55,65.19
CS_SEL0  (via drill 0.3)
  Top 0.127: v67.16,49.05 34.14,49.05 27.15,42.07 27.15,41.94 26.52,41.31 U9.11 | U7.11 77.19,42.58 77.19,43.34 76.55,43.98 76.05,43.98 75.54,44.48 75.54,44.74 v76.05,45.24 76.93,44.36 81.38,44.36 v81.76,44.74 | v133.96,42.96 135.1,41.82 U8.11 | v191.23,43.21 191.74,42.7 U6.11
  Bottom 0.127: v67.16,49.05 68.93,50.83 68.93,51.47 69.95,52.48 75.41,52.48 76.3,51.59 76.3,45.5 v76.05,45.24 | v191.23,43.21 134.21,43.21 v133.96,42.96 132.56,42.96 125.83,49.69 104.62,49.69 103.22,51.09 ESP_HDR_LEFT.5 103.1,51.09 101.95,49.94 100.18,49.94 99.41,50.71 99.41,51.34 98.27,52.48 92.81,52.48 91.79,51.47 91.79,50.83 85.7,44.74 v81.76,44.74
CS_SEL1  (via drill 0.3)
  Top 0.127: v52.42,34.83 50.14,37.12 31.72,37.12 28.42,40.42 28.42,40.55 27.78,41.18 U9.10 | v75.16,43.72 76.43,43.72 76.68,43.47 76.68,41.69 76.81,41.56 77.57,41.56 78.46,42.45 U7.10 78.59,42.45 79.22,41.82 79.22,41.69 79.35,41.56 80.11,41.56 81.76,43.21 v81.76,44.1 | v135.74,42.7 136.37,42.07 136.37,41.82 U8.10 | v192.5,42.7 193.01,42.7 U6.10
  Bottom 0.127: v52.42,34.83 62.46,34.83 65.89,31.4 66.39,31.4 74.14,39.15 74.14,42.7 v75.16,43.72 | v192.5,42.7 v135.74,42.7 134.34,42.7 134.08,42.45 132.69,42.45 125.7,49.44 99.79,49.44 98.14,51.09 ESP_HDR_LEFT.7 98.02,51.21 97,52.23 95.09,52.23 94.33,51.47 94.33,50.2 88.24,44.1 v81.76,44.1
CS_SEL2  (via drill 0.3)
  Top 0.127: v67.16,46.52 61.95,41.31 29.06,41.31 U9.9 | v76.05,44.61 76.3,44.61 77.44,43.47 78.84,43.47 79.73,42.58 U7.9 79.86,42.58 80.36,42.58 v81.25,43.47 | v131.04,43.47 135.99,43.47 137.64,41.82 U8.9 | v193.77,42.58 194.28,42.58 U6.9
  Bottom 0.127: v67.16,46.52 71.47,50.83 71.47,51.47 72.24,52.23 73.12,52.23 74.01,51.34 74.01,46.64 v76.05,44.61 | 95.6,51.09 103.22,43.47 v131.04,43.47 131.29,43.47 132.56,42.2 192.63,42.2 193.01,42.58 v193.77,42.58 | v81.25,43.47 87.98,43.47 95.6,51.09 | 95.6,51.09 ESP_HDR_LEFT.8
D0_A
  Top 0.127: R70.2 5.43,104.68 5.81,104.3 5.81,101.76 R71.2 5.94,101.63 6.32,101.63 19.91,88.04 24.74,88.04 U3.10
D0_A+
  Top 0.2: Q22.P$2 9.5,104.68 9.5,104.94 10.21,105.65 10.21,106.31 15.83,111.92 20.67,111.92 21.82,113.06 J8.8
D0_B
  Top 0.127: R73.2 14.32,104.68 14.7,104.3 14.7,101.76 R74.2 14.83,101.63 14.83,100.49 27.28,88.04 U3.11
D0_B+
  Top 0.2: Q23.P$2 18.46,104.88 26.64,113.06 26.9,113.06 J8.7
D0_C
  Top 0.127: R76.2 23.21,104.68 23.59,104.3 23.59,101.76 R77.2 23.72,101.63 23.72,94.14 29.82,88.04 U3.12
D0_C+
  Top 0.2: Q24.P$2 27.28,104.68 27.28,104.73 28.48,105.93 28.48,108.95 J8.6
D0_D
  Top 0.127: R79.2 32.1,104.68 32.48,104.3 32.48,101.76 R80.2 32.61,101.63 32.61,97.06 33.83,95.84 33.83,89.39 32.48,88.04 U3.13
D0_D+
  Top 0.2: Q25.P$2 36.31,104.58 37.36,105.62 37.36,112.92 J8.5
D0_E
  Top 0.127: R82.2 40.99,104.68 41.37,104.3 41.37,101.76 R83.2 41.37,101.63 41.37,101.12 36.17,95.92 36.17,89.19 35.02,88.04 U3.14
D0_E+
  Top 0.2: Q26.P$2 45.1,104.58 46.25,105.72 46.25,109.08 42.26,113.06 J8.4
D0_F
  Top 0.127: R100.2 48.61,104.68 48.99,104.3 48.99,101.76 R101.2 48.99,101.63 47.34,101.63 44.88,99.17 41.61,99.17 41.15,98.7 41.15,91.63 37.56,88.04 U3.15
D0_F+
  Top 0.2: Q32.P$2 53.08,104.58 53.87,105.37 53.87,106.99 47.8,113.06 47.34,113.06 J8.3
D0_G
  Top 0.127: R103.2 58.77,104.68 59.15,104.3 59.15,101.76 R104.2 59.15,101.63 54.96,101.63 42.52,89.19 41.25,89.19 40.1,88.04 U3.16
D0_G+
  Top 0.2: Q33.P$2 62.8,104.74 61.97,105.57 58.27,105.57 52.42,111.41 52.42,113.06 J8.2
D1_A
  Top 0.127: R85.2 74.01,104.68 74.39,104.3 74.39,101.76 R86.2 74.52,101.63 74.9,101.63 88.49,88.04 94.71,88.04 U4.10
D1_A+
  Top 0.2: Q27.P$2 78.14,104.84 84.76,111.47 88.8,111.47 90.4,113.06 J6.8
D1_B
  Top 0.127: R88.2 82.9,104.68 83.28,104.3 83.28,101.76 R89.2 83.41,101.63 83.66,101.63 97.25,88.04 U4.11
D1_B+
  Top 0.2: Q28.P$2 87.03,104.84 95.25,113.06 95.48,113.06 J6.7
D1_C
  Top 0.127: R91.2 91.79,104.68 92.17,104.3 92.17,101.76 R92.2 92.3,101.63 92.3,95.54 99.79,88.04 U4.12
D1_C+
  Top 0.127: 95.86,104.83 95.86,104.68 Q29.P$2
  Top 0.2: 95.86,104.83 100.56,109.53 100.56,113.06 J6.6
D1_D
  Top 0.127: R94.2 100.68,104.68 101.06,104.3 101.06,101.76 R95.2 101.19,101.63 101.19,96.81 101.44,96.55 101.44,96.3 101.19,96.05 101.19,89.19 102.33,88.04 U4.13
D1_D+
  Top 0.127: 104.72,104.61 Q30.P$2
  Top 0.2: 104.72,104.61 105.94,105.82 105.94,112.92 J6.5
D1_E
  Top 0.127: R97.2 109.57,104.68 109.95,104.3 109.95,101.76 R98.2 109.95,101.63 109.95,99.73 106.27,96.05 106.27,93.25 106.4,93.12 106.4,89.44 105,88.04 U4.14
D1_E+
  Top 0.127: 113.64,104.73 113.64,104.68 Q31.P$2
  Top 0.2: 113.64,104.73 114.73,105.82 114.73,109.18 110.84,113.06 J6.4
D1_F
  Top 0.127: R106.2 119.73,104.68 120.11,104.3 120.11,101.76 R107.2 120.11,101.63 115.92,101.63 113.63,99.34 111.22,99.34 111.22,96.43 111.35,96.3 111.35,91.85 107.54,88.04 U4.15
D1_F+
  Top 0.127: 123.62,104.68 123.67,104.68 Q34.P$2
  Top 0.2: 123.62,104.68 122.73,105.57 119.22,105.57 115.92,108.87 115.92,113.06 J6.3
D1_G
  Top 0.127: R109.2 128.62,104.68 129,104.3 129,101.76 R110.2 129,101.63 126.84,101.63 114.4,89.19 111.22,89.19 110.08,88.04 U4.16
D1_G+
  Top 0.127: 132.69,104.68 Q35.P$2
  Top 0.2: 132.69,104.68 132.69,105.32 133.72,106.35 133.72,106.97 129.42,111.27 122.8,111.27 121,113.06 J6.2
D2_A
  Top 0.127: R112.2 143.86,104.68 143.86,102.14 144.24,101.76 R113.2 144.37,101.63 144.75,101.63 158.21,88.17 165.58,88.17 U5.10
D2_A+
  Top 0.2: Q36.P$2 147.99,104.84 155.43,112.28 158.19,112.28 158.98,113.06 J7.8
D2_B
  Top 0.127: R115.2 154.02,104.68 154.02,102.14 154.4,101.76 R116.2 154.53,101.63 168.12,88.04 U5.11
D2_B+
  Top 0.2: Q37.P$2 158.09,104.68 158.09,104.83 164.06,110.8 164.06,113.06 J7.7
D2_C
  Top 0.127: R118.2 164.18,104.68 164.18,102.14 164.56,101.76 R119.2 164.69,101.63 164.69,100.74 169.52,95.92 169.52,89.31 170.66,88.17 U5.12
D2_C+
  Top 0.2: Q38.P$2 168.29,104.58 169.49,105.78 169.49,112.84 169.26,113.06 J7.6
D2_D
  Top 0.127: R121.2 174.34,104.68 174.34,102.14 174.72,101.76 R122.2 174.82,101.69 174.82,96.4 174.34,95.92 174.34,89.19 173.33,88.17 U5.13
D2_D+
  Top 0.2: Q39.P$2 178.41,104.68 178.41,104.73 179.6,105.92 179.6,107.81 174.34,113.06 J7.5
D2_E
  Top 0.127: 183.23,102.14 183.23,104.68 R124.2 | 183.23,102.14 183.61,101.76 R125.2 | 183.23,102.14 180.69,99.6 180.57,99.6 177.14,96.17 177.14,89.44 175.87,88.17 U5.14
D2_E+
  Top 0.2: Q40.P$2 187.17,104.68 187.12,104.68 186.23,105.57 182.73,105.57 179.42,108.87 179.42,113.06 J7.4
D2_F
  Top 0.127: R127.2 192.12,104.68 192.12,102.14 192.5,101.76 R128.2 192.5,101.63 192.5,100.11 181.58,89.19 179.42,89.19 178.41,88.17 U5.15
D2_F+
  Top 0.2: Q41.P$2 196.15,104.64 195.22,105.57 191.42,105.57 184.5,112.48 184.5,113.06 J7.3
D2_G
  Top 0.127: 201.01,102.14 201.01,104.68 R130.2 | 201.01,102.14 201.39,101.76 R131.2 | 201.01,102.14 198.98,102.14 186.03,89.19 181.96,89.19 180.95,88.17 U5.16
D2_G+
  Top 0.2: Q42.P$2 205.04,104.64 204.11,105.57 199.44,105.57 195.95,109.05 192.89,109.05 189.53,112.42 J7.2
EN
  Top 0.127: 185.52,64.3 185.52,66.45 REG.1 | 185.52,64.3 184.88,63.66 CEN.2 184.76,63.53 184.12,62.9 184.12,61.63 184.76,60.99 184.76,59.34 REN.2 | 185.52,64.3 187.93,61.88 188.19,61.88 DEN.P$3 188.31,61.75 188.57,61.75 192.63,57.69 193.14,57.69 EN.1
EN_F
  Top 0.127: R31.1 157.2,58.58 157.2,59.6 157.32,59.72 U2.3
FB
  Top 0.127: REG.2 185.65,66.96 186.92,66.96 R2.2 | R1.1 188.44,65.31 186.92,66.83 R2.2 | R2.2 187.04,66.96 187.04,68.49 187.55,68.99 FB.1
GND  (via drill 0.3, 0.35, 0.8 pad 1.3)
  Top 0.127: 173.33,79.79 R23.1 | 181.96,67.6 REG.15 | REG.14 181.96,67.98 181.96,68.37 181.93,68.4 | 181.96,68.61 REG.13 | REG.14 181.96,68.11 181.96,68.49 REG.13 | 186.15,70.26 186.15,71.53 RECT.3 185.58,72.26 | 186.15,70.26 186.15,67.98 185.77,67.6 185.65,67.6 REG.3 | 192.76,67.98 192,68.74 C2.1 191.87,68.87 190.47,70.26 186.15,70.26 | 192.76,67.98 193.27,67.47 197.2,67.47 197.46,67.72 197.46,67.85 D7.1 | 192.76,67.98 189.07,64.3 187.93,64.3 187.04,65.18 R1.2 | 181.29,69.04 REG.12 181.96,69.01 181.96,69.16 | CVC.2 182.09,62.26 183.23,62.26 CSS.2 183.36,62.14 183.36,60.36 184.12,59.6 184.12,58.83 184.38,58.58 185.26,58.58 186.92,60.23 | CTON.2 180.69,56.93 187.17,56.93 187.68,56.42 188.57,56.42 189.33,57.18 189.33,58.07 187.68,59.72 187.42,59.72 DEN.P$1 187.3,59.85 186.92,60.23 | 186.92,60.23 185.14,62.01 184.88,62.01 CEN.1 | 171.15,66.96 171.93,66.96 COUT2.1 171.8,66.96 | 174.6,66.96 COUT1.1 | 165.45,66.83 COUT4.1 165.33,66.83 | 168.88,66.83 COUT3.1 169.01,66.96 | 157.2,65.95 C5.1 157.2,66.07 | 157.2,64.3 C4.1 157.2,64.17 156.56,63.53 156.56,59.85 U2.2 156.56,59.72 156.69,59.6 156.69,58.2 154.91,56.42 154.66,56.42 C3.1 | 160.25,74.07 R16.1 | 174.34,79.79 174.34,88.68 175.74,90.08 175.74,95.66 U5.5 | U4.3 109.95,95.66 107.54,95.66 U4.4 | v33.68,85.92 15.76,68 TP4.TP | 34.9,95.54 U3.5 | 82.78,78.9 ESP_HDR_RIGHT.13 | 37.56,95.66 U3.4 | 39.98,95.66 U3.3 | REG.13 181.79,68.54 181.93,68.4 | 181.93,68.4 REG.14 | CIN1.1 176.28,74.59 176.31,74.62 | 176.15,79.79 CIN3.1 | 109.57,112.68 114.27,107.98 114.27,105.95 114.15,105.82 113.12,105.82 R99.1 | 109.57,112.68 109.57,113.7 110.21,114.33 117.07,114.33 124.43,106.97 124.43,104.94
  Top 0.127: 124.43,104.94 124.43,104.05 124.34,103.96 124.31,103.92 | 129.64,104.81 129,105.44 126.84,105.44 126.34,104.94 124.43,104.94 | 81.46,108.67 84.71,111.92 87.47,111.92 89.89,114.33 96.11,114.33 96.75,113.7 | 81.46,108.67 78.61,105.82 78.08,105.82 77.06,104.81 76.55,104.81 R87.1 | 96.75,113.7 96.75,106.2 95.73,105.19 94.71,105.19 | 81.46,108.67 v81.38,108.75 | 105.48,110.04 v105.13,110.4 101.19,114.33 97.38,114.33 96.75,113.7 | v108.81,112.68 109.57,112.68 | v84.3,105.82 85.36,104.77 R90.1 | R105.1 59.58,104.77 v59.53,104.81 | R75.1 17.83,105.79 17.84,105.79 | R72.1 8.59,104.1 8.59,103.72 | U9.4 23.97,35.85 25.12,35.85 U9.5 25.25,35.85 26.39,35.85 U9.6 26.52,35.72 26.52,35.21 27.53,34.2 v27.53,33.94 27.53,29.75 CEN11.1 | 36.55,17.05 37.06,17.56 37.18,17.56 37.44,17.81 37.44,22.13 36.17,23.4 U16.4 36.17,23.53 37.82,25.18 38.2,25.18 3V19.2 38.33,25.31 38.58,25.31 38.96,25.69 38.96,26.2 36.04,29.12 | 36.55,17.05 34.77,15.27 R60.1 | 36.04,29.12 36.04,29.75 CEN9.1 | 34.14,30.64 33.75,30.26 33.75,29.37 34.01,29.12 36.04,29.12 | 34.14,30.64 34.26,30.77 43.28,30.77 44.04,30.01 44.55,30.01 CEN20.1 | 34.14,30.64 29.18,35.59 | 29.18,35.59 29.06,35.72 U9.8 29.18,35.59 | 29.18,35.59 v28.42,34.83 | 3.53,25.43 3.27,25.69 3.27,26.2 7.47,30.39 9.24,30.39 9.88,29.75 CEN12.1 | 3.53,25.43 3.66,25.31 3.91,25.31 3V11.2 | R69.1 8.1,15.27 9.5,15.27 10.13,15.91 11.02,15.91 11.53,15.4 11.53,8.41 13.05,6.89 J5.1 13.18,6.76 16.23,6.76 17.62,5.37 18.9,5.37 20.55,7.02 | v3.15,25.05 3.53,25.43 | 3V9.2 12.29,25.81 11.91,25.81 10.26,24.16 10.26,23.53 U20.4 10.26,23.4 10.26,20.86 14.62,16.5 14.62,14.85 14.7,14.77
  Top 0.127: 14.7,14.77 15.97,14.77 16.36,15.15 16.86,15.15 R66.1 | 3V8.2 29.56,25.18 28.67,25.18 27.91,24.42 27.91,23.53 U18.4 27.91,23.4 27.91,20.1 29.54,18.48 29.54,7.55 29.69,7.4 29.69,6.13 28.93,5.37 27.78,5.37 25.88,7.27 | 23.59,14.77 24.86,14.77 25.25,15.15 25.75,15.15 R63.1 | 23.59,14.77 23.41,14.95 23.41,16.6 18.77,21.24 18.77,23.27 18.64,23.4 U17.4 18.64,23.53 20.8,25.69 21.18,25.69 3V10.2 21.31,25.81 21.56,25.81 21.82,26.07 21.82,26.7 21.44,27.08 v21.44,33.94 21.44,35.72 U9.2 | 25.88,7.27 23.59,9.56 23.59,14.77 | 14.7,14.77 14.7,12.86 20.55,7.02 | 20.55,7.02 22.2,5.37 23.97,5.37 25.88,7.27 | 79.22,25.43 81.12,25.43 3V17.2 | 79.22,25.43 78.71,24.92 78.71,23.53 U14.4 78.84,23.4 80.62,21.62 80.62,17.81 80.36,17.56 80.24,17.56 79.73,17.05 | 79.73,17.05 77.95,15.27 R48.1 | 79.22,25.43 78.84,25.81 78.84,26.45 79.22,26.83 79.22,28.61 78.71,29.12 78.71,29.75 CEN7.1 | R42.1 95.73,15.27 98.02,17.56 98.14,17.56 98.4,17.81 98.4,22.51 97,23.91 97,24.16 U13.4 97,24.29 97.51,24.8 97.51,29.24 96.62,30.13 96.62,30.39 CEN6.1 96.49,30.51 96.11,30.51 95.48,31.15 90.14,31.15 88.49,29.5 | 76.43,37.5 76.43,43.34 76.3,43.47 75.54,43.47 75.41,43.34 75.41,41.69 75.66,41.44 75.66,41.18 74.78,40.29 74.78,37.12 U7.4 | 76.43,37.5 76.05,37.12 U7.5 | 76.43,37.5 76.81,37.12 77.19,37.12 U7.6 77.19,36.99 78.08,36.1 78.84,36.1 79.35,36.61 | 79.35,36.61 79.73,36.99 U7.8 | 88.49,25.81 88.11,25.81 87.73,25.43 87.73,23.91 U26.4 87.86,23.78 89.51,22.13 89.51,17.18 87.6,15.27 86.84,15.27 R45.1 86.71,15.15 86.33,14.77 85.32,14.77 84.55,14 84.55,6.38 83.54,5.37 82.4,5.37 81.38,6.38 81.18,6.38
  Top 0.127: 88.49,25.81 90.4,25.81 3V5.2 | 88.49,29.5 87.98,30.01 87.47,30.01 CEN18.1 87.35,30.13 86.71,30.77 85.19,30.77 79.35,36.61 | 88.49,25.81 88.49,29.5 | 79.73,17.05 81.18,15.6 81.18,6.38 | 71.22,25.31 70.58,25.31 70.08,24.8 70.08,23.66 U27.4 | 71.22,25.31 72.11,25.31 3V6.2 | 69.95,29.37 71.22,28.1 71.22,25.31 | 69.95,29.37 69.82,29.5 69.82,29.88 CEN19.1 69.82,30.01 72.11,32.29 72.11,36.99 U7.2 | 63.09,25.69 63.34,25.69 3V18.2 63.09,25.69 | 63.09,25.69 61.44,24.04 61.44,23.78 U15.4 61.44,23.66 64.11,20.99 64.11,17.43 66.77,14.77 | 66.77,14.77 68.04,14.77 68.43,15.15 68.93,15.15 R51.1 | v62.2,28.86 61.19,29.88 CEN8.1 | v62.2,27.34 62.2,26.58 63.09,25.69 | v69.69,29.12 69.95,29.37 | 63.34,7.53 63.34,14.13 63.09,14.38 62.2,14.38 61.44,15.15 60.17,15.15 R54.1 60.04,15.15 59.53,15.15 59.15,14.77 57.38,14.77 55.09,17.05 46.33,17.05 | 63.34,7.53 62.71,6.89 J4.1 63.34,7.53 | 3V7.2 54.71,25.81 46.84,25.81 44.93,23.91 U28.4 44.93,23.78 46.33,22.38 46.33,17.05 | 46.33,17.05 44.55,15.27 43.66,15.27 R57.1 43.53,15.15 43.15,14.77 42.14,14.77 41.37,14 41.37,7.65 39.09,5.37 37.94,5.37 37.06,6.26 37.06,7.4 37.94,8.29 37.94,15.65 36.55,17.05 | 66.77,14.77 66.77,9.68 69.06,7.4 69.06,6.13 | 69.06,6.13 68.3,5.37 65.5,5.37 63.34,7.53 | 81.18,6.38 79.47,6.38 78.46,5.37 69.82,5.37 69.06,6.13 | 195.55,26.07 197.58,26.07 3V12.2 | 195.55,26.07 195.04,25.56 195.04,23.91 U1.4 195.04,23.78 197.08,21.75 197.08,18.32 194.66,15.91 194.41,15.91 R10.1 | 195.55,26.07 195.55,28.86 194.66,29.75 194.66,30.13 CEN2.1 194.66,30.26 v195.68,30.26 | R25.1 214.73,15.91 214.98,15.91 217.4,18.32 217.4,21.24 214.98,23.66 U19.4 214.86,23.78
  Top 0.127: U6.2 186.79,37.12 187.68,36.23 188.44,36.23 189.33,37.12 U6.4 189.33,37.24 190.47,37.24 U6.5 190.6,37.24 191.74,37.24 U6.6 191.87,37.12 192.76,36.23 193.52,36.23 | 193.52,36.23 193.65,36.35 193.65,36.48 194.28,37.12 U6.8 | 205.46,25.81 205.2,25.81 204.82,25.43 204.82,23.91 U21.4 204.82,23.78 207.24,21.37 207.24,18.32 204.82,15.91 204.57,15.91 R7.1 | 205.46,25.81 207.36,25.81 3V21.2 207.49,25.94 207.74,25.94 208.12,26.32 208.12,27.72 211.3,30.89 213.84,30.89 214.22,30.51 214.22,30.39 214.6,30.01 CEN1.1 | v205.46,29.12 204.57,30.01 CEN13.1 | 205.46,25.81 v205.46,26.07 | v193.52,34.45 193.52,36.23 | 137.8,36.23 137.77,36.23 U8.8 | 137.8,36.23 140.31,36.23 146.15,30.39 146.53,30.39 CEN4.1 146.66,30.26 v148.18,30.26 | R27.1 146.66,15.4 148.05,15.4 148.69,14.77 149.58,14.77 149.83,15.02 149.83,21.11 146.91,24.04 U11.4 146.91,24.16 148.82,26.07 152.88,26.07 3V14.2 153.01,26.2 153.39,26.2 153.64,26.45 | 153.64,26.45 153.64,28.73 154.79,29.88 157.83,29.88 158.59,30.64 158.85,30.64 CEN15.1 | v157.45,26.45 159.1,24.8 159.1,24.29 U23.4 | 153.64,26.45 v153.9,26.45 | 167.49,25.43 167.23,25.43 3V2.2 | 167.49,25.43 168.88,26.83 168.88,28.23 169.77,29.12 | 169.9,29.12 172.82,29.12 173.45,29.75 CEN3.1 | 167.87,15.65 166.98,14.77 160.12,14.77 159.48,15.4 158.09,15.4 R21.1 | 167.87,15.65 170.41,15.65 170.79,15.27 173.45,15.27 173.96,15.78 R18.1 174.09,15.91 174.85,15.91 175.11,16.16 | 175.11,16.16 176.76,17.81 176.76,19.64 173.84,22.56 173.84,23.4 U10.4 | 167.49,25.43 167.87,25.05 167.87,15.65 | 167.49,25.43 3V2.2 | 186.53,15.65 186.66,15.78 R14.1 186.53,15.65
  Top 0.127: 186.53,15.65 186.03,15.15 181.07,15.15 179.7,16.52 179.7,23.25 176.76,26.2 176.5,26.2 3V13.2 | 186.03,26.07 187.3,26.07 3V1.2 | 186.03,26.07 185.52,25.56 185.52,23.78 U22.4 185.52,23.66 185.52,21.75 188.27,19 188.27,9.22 189.46,8.03 189.46,6.89 188.57,6 186.66,6 | 186.03,28.73 185.26,29.5 185.26,29.88 CEN14.1 | 186.03,26.07 186.03,28.73 | 186.66,6 179.3,6 177.9,7.4 J2.1 177.77,7.53 177.77,14.26 177.01,15.02 176.25,15.02 175.11,16.16 | 186.53,15.65 187.42,14.77 187.42,8.8 186.66,8.03 186.66,6 | v164.82,26.45 165.83,25.43 167.1,25.43 3V2.2 | 186.03,28.73 v187.81,28.73 | 125.19,24.29 U12.4 125.19,24.16 | 125.07,15.53 R36.1 125.07,15.4 | U8.4 132.69,36.35 133.83,36.35 U8.5 133.96,36.35 135.1,36.35 U8.6 134.6,35.8 v134.6,33.5 | 134.03,31.23 | U25.4 116.43,23.78 118.72,26.07 118.97,26.07 3V4.2 119.1,26.2 119.48,26.2 120.37,27.08 120.37,28.61 122.65,30.89 124.94,30.89 124.94,31.15 | 126.23,37.77 118.71,30.26 116.18,30.26 CEN17.1 | 126.3,37.77 126.23,37.77 | 130.15,36.35 U8.2 | 124.94,30.26 CEN5.1 | 129.13,25.56 3V15.2 | 110.46,25.31 3V16.2 | 114.78,15.4 R39.1 114.91,15.4 | 140.56,25.94 3V3.2 | 135.61,23.78 U24.4 | 119.86,7.14 J3.1 | 171.15,57.14 171.3,57 | 122.63,41.5 122.63,41.47 | 123.8,40.33 v123.8,40.3 | 126.23,37.97 126.23,37.77 | v137.4,33.5 137.8,33.9 137.8,36.23
  Top 0.2: 8.59,103.72 10.21,103.72 10.77,104.28 10.77,106.08 11.98,107.29 19.32,107.29 19.32,107.27 | 17.84,105.79 18.86,105.79 19.12,106.05 19.12,107.07 19.32,107.27 | 34.37,112.98 32.41,114.93 30.47,114.93 | 34.37,112.98 37,110.34 37,106.15 36.68,105.82 35.65,105.82 R81.1 | 30.47,114.93 26.99,114.93 19.32,107.27 | 39.88,113.08 39.83,113.13 39.68,112.98 37.53,115.13 36.52,115.13 34.37,112.98 | 53.06,105.82 53.39,105.82 53.51,105.95 53.51,106.87 48.46,111.92 45.88,111.92 42.3,115.5 39.88,113.08 | 39.88,113.08 39.83,113.03 45.89,106.97 45.89,106.15 45.56,105.82 44.54,105.82 R84.1 | 53.06,105.82 v53.06,105.7 | 30.47,114.93 28.07,112.53 28.07,106.11 27.78,105.82 26.76,105.82 R78.1 | 105.48,110.04 105.48,106.05 105.25,105.82 104.23,105.82 R96.1 | 160.55,114.4 160.55,107.78 158.16,105.39 157.13,105.39 R117.1 | R114.1 146.4,104.81 146.95,104.81 147.99,105.85 148.43,105.85 155.3,112.72 156.65,112.72 158.57,114.63 159.31,114.63 160.05,113.9 160.55,114.4 | 160.55,114.4 160.78,114.63 164.59,114.63 168.88,110.34 v168.88,110.14 168.98,110.04 168.98,106.05 168.75,105.82 168.25,105.82 167.19,104.77 R120.1 | 188.23,104.48 188.23,104.35 187.81,103.92 186.53,103.92 185.72,104.73 R126.1 | 188.23,104.48 188.23,104.68 188.03,104.68 188.03,106.88 187.8,107.11 184.29,107.11 180.6,110.8 180.6,113.7 179.67,114.63 174.01,114.63 173.07,113.7 173.07,112.17 v173.33,112.17 173.58,111.92 174.39,111.92 179.14,107.17 179.14,106.05 178.92,105.82 177.89,105.82 R123.1 | 188.23,104.48 v190.84,104.48 | 94.71,105.19 94.7,105.19 R93.1 94.28,104.79 v95.19,105.7 | 129.64,104.81 129.68,104.77 R111.1
  Top 0.2: R102.1 52.16,105.82 53.06,105.82 | v201.78,104.68 201.86,104.77 R132.1 | v192.88,104.68 194.52,104.68 R129.1 | 214.86,23.78 214.86,24.99 213.78,26.07 v213.08,26.07 | U8.6 135.13,35.63 134.03,34.53 134.03,31.23 | 134.03,31.23 CEN16.1 | 130.15,36.35 128.63,37.87 | 124.34,103.96 124.31,103.96 124.3,103.95 123.04,103.95 R108.1
  Top 0.3: 110.46,25.31 109.78,25.31 109.45,24.97 109.45,18.22 109.47,18.22 110.34,17.35 v110.34,16.91 110.34,16.86 111.34,15.86 111.34,15.18 111.9,14.62 113.5,14.62 | 113.5,14.62 114,14.62 114.78,15.4 | 114.91,15.4 116.3,15.4 116.97,14.74 118.36,14.74 118.93,14.17 118.93,8.08 119.86,7.14 | 125.19,22.2 125.19,20.12 126.27,19.04 126.27,17.43 | 126.27,17.43 126.3,17.4 | 126.27,17.43 126.24,17.4 125,17.4 125,15.54 R36.1 | 113.5,14.62 113.2,14.92 v113.2,15.3 | v108.2,15.6 108.1,15.7 v108.1,16.9
  Top 0.5: 173.33,79.79 174.34,79.79 176.15,79.79 | 181.96,67.98 181.96,67.6 | 181.96,69.01 181.96,68.61 | 181.26,69.86 181.96,69.16 | 3V15.2 129.05,25.53 125.19,25.53 125.19,24.29 | 125.19,24.16 125.19,22.2 126.7,22.2 128.8,20.1 v128.8,17 | 124.94,30.89 124.94,30.26 | 127.22,32.43 129.13,34.34 130.1,34.34 | 124.94,31.15 126.72,32.93 127.22,32.43 | 130.1,34.34 131.27,34.34 132.59,35.66 U8.4 | 130.02,36.3 U8.2 130.06,34.38 130.1,34.34 | 129.13,25.56 130.17,25.56 130.17,29.98 128.82,31.32 128.32,31.32 127.22,32.43 | 140.56,25.94 136.58,25.94 135.61,24.97 135.61,23.78 | R30.1 135,15.7 v133.59,15.7 | U24.4 135.78,23.57 135.78,22.69 v135.48,22.38 | v125.96,14.51 125.07,15.4 | CTON.2 180.59,54.16 179.43,53 175.3,53 171.3,57 169.9,58.4 169.9,29.12 | v126.5,16.9 125.13,15.53 125.07,15.53
  Top 0.8: 181.29,69.04 181.79,68.54
  Top 1: 181.26,69.86 183.67,72.26 185.58,72.26 | 179.72,70.61 181.29,69.04 | 174.6,66.96 171.93,66.96 | 168.88,66.83 165.45,66.83 | 169.01,66.96 171.8,66.96 | 157.2,64.3 157.2,65.95 | 160.25,69.12 160.25,74.07 | 157.2,66.07 160.25,69.12 | 165.33,66.83 162.53,66.83 160.25,69.12 | 171.15,66.96 171.15,57.14 | 179.72,70.61 176.13,67.02 COUT1.1 | ESP_HDR_RIGHT.19 67.58,78.77 70.07,76.28 80.16,76.28 82.78,78.9 | 39.98,95.66 37.56,95.66 | 179.72,70.61 177.53,72.8 176.3,72.8 CIN1.1 | CIN3.1 CIN2.1 CIN1.1 | v84.4,70.2 v86.2,70.2 | v147.6,74.4 155.7,74.4 v155.8,74.3 | 128.63,37.87 126.4,37.87 126.3,37.77 | v128.3,60.7 122.63,55.03 122.63,41.5 123.8,40.33 | v125.2,39 126.23,37.97